# Altium project Audio_Research.PrjPcb (part 2 of 4)

## Sheet Power.SchDoc: Power Regulation
size 279 x 215 mm; DrawnBy: Connor Dack; Engineer: Connor Dack; DocumentNumber: 10; Revision: 1.0; SheetNumber: 10; SheetTotal: 20
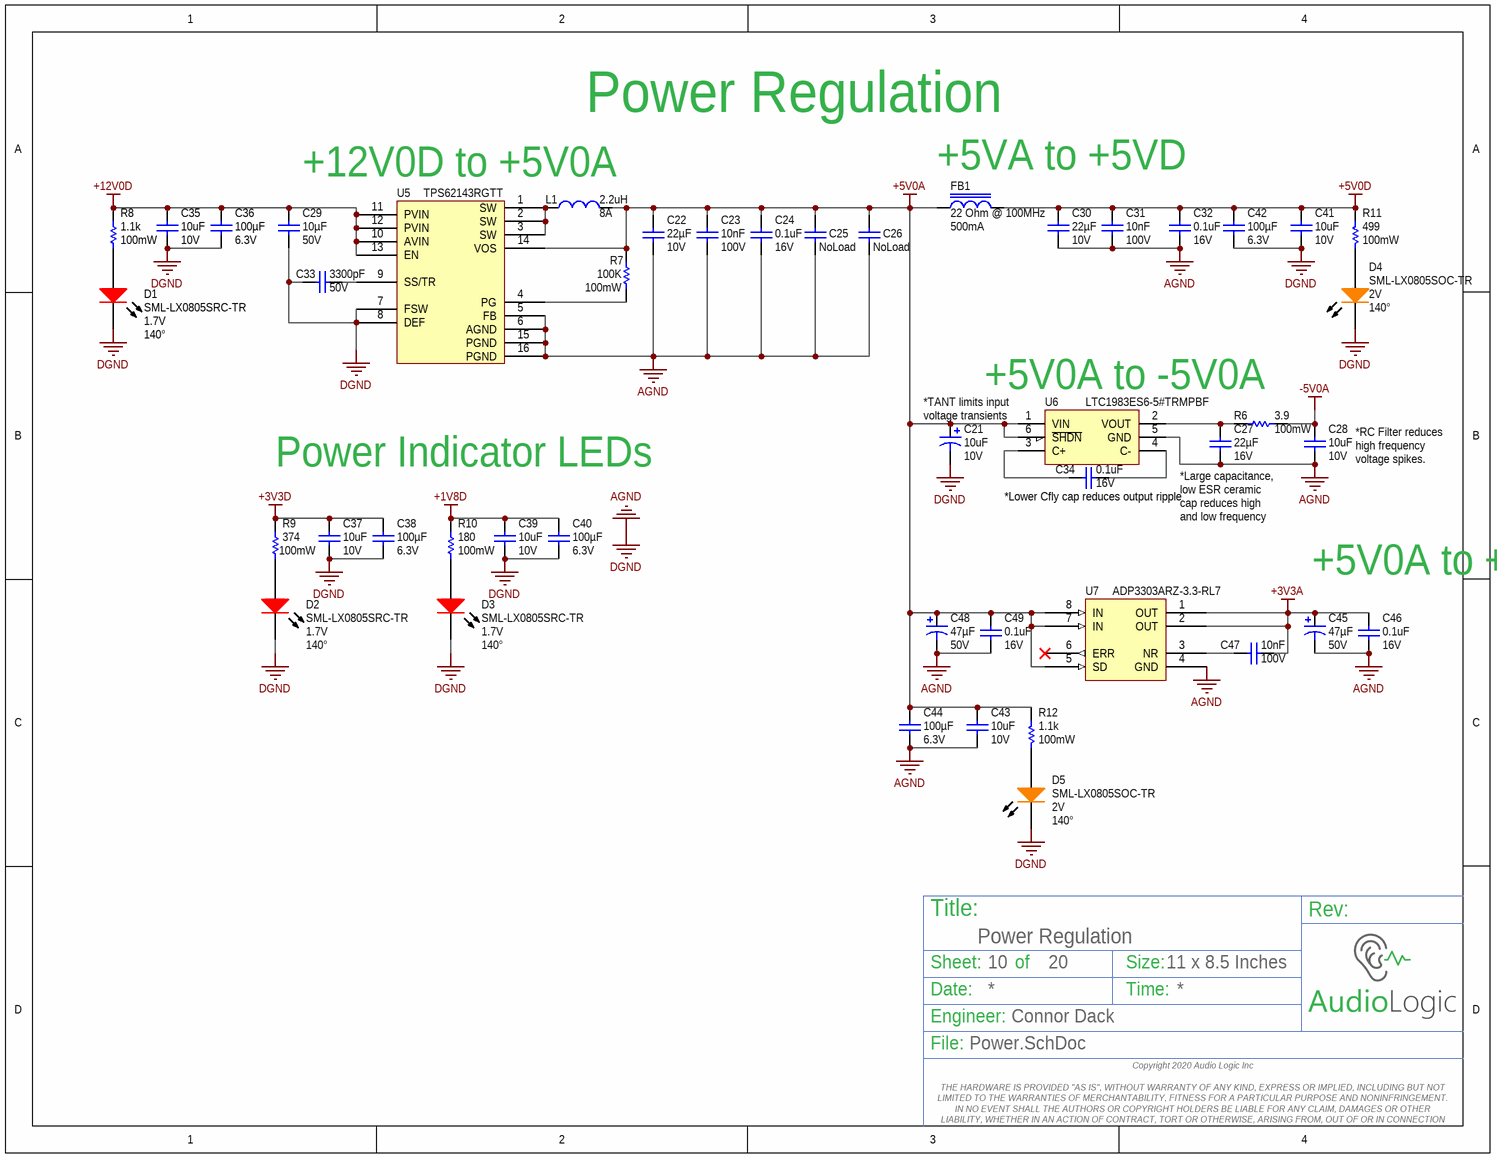
[diagram p5: Power.SchDoc]

### Parts
C21  Voltage: 10V  Capacitance: 10uF  [C1206_TANT]  (hidden comment: TR3A106K010C0900)
C22  Voltage - Rated: 10V  Capacitance: 22µF  [6-0805_L]  (hidden comment: CL21A226KPCLRNC)
C23  Voltage Rating: 100V  Capacitance: 10nF  [3-0603_L]  (hidden comment: C1608X8R2A103K080AA)
C24  Voltage Rating: 16V  Capacitance: 0.1uF  [3-0603_L]  (hidden comment: CL10F104ZO8NNNC)
C25  Capacitance: NoLoad  [3-0603_L]  (hidden comment: CAP 0603)
C26  Capacitance: NoLoad  [3-0603_L]  (hidden comment: CAP 0603)
C27  Voltage - Rated: 16V  Capacitance: 22µF  [C1206]  (hidden comment: C3216X6S1C226M)
C28  Voltage Rating: 10V  Capacitance: 10uF  [3-0603_L]  (hidden comment: GRM188R61A106ME69D)
C29  Voltage - Rated: 50V  Capacitance: 10µF  [C1206]  (hidden comment: C3216X5R1H106K)
C30  Voltage - Rated: 10V  Capacitance: 22µF  [6-0805_L]  (hidden comment: CL21A226KPCLRNC)
C31  Voltage Rating: 100V  Capacitance: 10nF  [3-0603_L]  (hidden comment: C1608X8R2A103K080AA)
C32  Voltage Rating: 16V  Capacitance: 0.1uF  [3-0603_L]  (hidden comment: CL10F104ZO8NNNC)
C33  Voltage - Rated: 50V  Capacitance: 3300pF  [6-0805_L]  (hidden comment: GRM2165C1H332JA01D)
C34  Voltage Rating: 16V  Capacitance: 0.1uF  [3-0603_L]  (hidden comment: CL10F104ZO8NNNC)
C35  Voltage Rating (DC): 10V  Capacitance: 10uF  [3-0603_L]  (hidden comment: GRM188R61A106ME69D)
C36  Voltage - Rated: 6.3V  Capacitance: 100µF  [C1210X25_L]  (hidden comment: CL32X107MQVNNNE)
C37  Voltage Rating: 10V  Capacitance: 10uF  [3-0603_L]  (hidden comment: GRM188R61A106ME69D)
C38  Voltage - Rated: 6.3V  Capacitance: 100µF  [C1210X25_L]  (hidden comment: CL32X107MQVNNNE)
C39  Voltage Rating: 10V  Capacitance: 10uF  [3-0603_L]  (hidden comment: GRM188R61A106ME69D)
C40  Voltage - Rated: 6.3V  Capacitance: 100µF  [C1210X25_L]  (hidden comment: CL32X107MQVNNNE)
C41  Voltage Rating: 10V  Capacitance: 10uF  [3-0603_L]  (hidden comment: GRM188R61A106ME69D)
C42  Voltage - Rated: 6.3V  Capacitance: 100µF  [C1210X25_L]  (hidden comment: CL32X107MQVNNNE)
C43  Voltage Rating: 10V  Capacitance: 10uF  [3-0603_L]  (hidden comment: GRM188R61A106ME69D)
C44  Voltage - Rated: 6.3V  Capacitance: 100µF  [C1210X25_L]  (hidden comment: CL32X107MQVNNNE)
C45  Voltage Rating: 50V  Capacitance: 47µF  [ALUMCAPC630D_D]  (hidden comment: EEE-FT1H470AP)
C46  Voltage Rating: 16V  Capacitance: 0.1uF  [3-0603_L]  (hidden comment: CL10F104ZO8NNNC)
C47  Voltage Rating: 100V  Capacitance: 10nF  [3-0603_L]  (hidden comment: C1608X8R2A103K080AA)
C48  Voltage Rating: 50V  Capacitance: 47µF  [ALUMCAPC630D_D]  (hidden comment: EEE-FT1H470AP)
C49  Voltage Rating: 16V  Capacitance: 0.1uF  [3-0603_L]  (hidden comment: CL10F104ZO8NNNC)
D1  Manufacturer Part Number: SML-LX0805SRC-TR  Voltage - Forward (Vf) (Typ): 1.7V  Viewing Angle: 140°  [DIOM2012X12L_RED]  (hidden comment: LED_RED 4)
D2  Manufacturer Part Number: SML-LX0805SRC-TR  Voltage - Forward (Vf) (Typ): 1.7V  Viewing Angle: 140°  [DIOM2012X12L_RED]  (hidden comment: LED_RED 4)
D3  Manufacturer Part Number: SML-LX0805SRC-TR  Voltage - Forward (Vf) (Typ): 1.7V  Viewing Angle: 140°  [DIOM2012X12L_RED]  (hidden comment: LED_RED 4)
D4  Manufacturer Part Number: SML-LX0805SOC-TR  Voltage - Forward (Vf) (Typ): 2V  Viewing Angle: 140°  [DIOM2012X12L_ORANGE]  (hidden comment: LED_ORANGE 3)
D5  Manufacturer Part Number: SML-LX0805SOC-TR  Voltage - Forward (Vf) (Typ): 2V  Viewing Angle: 140°  [DIOM2012X12L_ORANGE]  (hidden comment: LED_ORANGE 3)
FB1  Current Rating: 500mA  Impedance @ Frequency: 22 Ohm @ 100MHz  [3-0603_L]  (hidden comment: BLM18BA220SN1D)
L1  Max DC Current: 8A  Inductance: 2.2uH  [XFL4020]  (hidden comment: 2.2uH Ind)
R6  Power (Watts): 100mW  Resistance (Ohms): 3.9  [3-0603_R_L]  (hidden comment: ERJ-3RQF3R9V)
R7  Power (Watts): 100mW  Resistance (Ohms): 100K  [3-0603_R_L]  (hidden comment: ERJ-3EKF1003V)
R8  Power Rating: 100mW  Resistance: 1.1k  [3-0603_R_L]  (hidden comment: RMCF0603FT1K10)
R9  Power (Watts): 100mW  Resistance (Ohms): 374  [3-0603_R_L]  (hidden comment: ERJ-3EKF3740V)
R10  Power Rating: 100mW  Resistance: 180  [3-0603_R_L]  (hidden comment: ERA-3AEB181V)
R11  Power (Watts): 100mW  Resistance (Ohms): 499  [3-0603_R_L]  (hidden comment: ERJ-3EKF4990V)
R12  Power Rating: 100mW  Resistance: 1.1k  [3-0603_R_L]  (hidden comment: RMCF0603FT1K10)
U5  IC REG BUCK 5V 2A SYNC 16QFN  [QFN50P300X300X100_HS-17N]  (value not drawn)
U6  (no value)  [SOT23-6_L]
U7  ADP3303ARZ-3.3-RL7  [SOIC127P600X175-8L]

### Nets
+1V8D: C39.2 C40.2 R10.2
+3V3A: C45.1(P) C46.1 C47.1 U7.1(OUT) U7.2(OUT)
+3V3D: C37.2 C38.2 R9.2
+5V0A: C21.1(P) C22.2 C23.2 C24.1 C25.2 C26.2 C43.2 C44.2 C48.1(P) C49.1 FB1.1 L1.2 R7.2 R12.2 U5.14(VOS) U6.1(VIN) U6.6(~{SHDN}) U7.5(SD) U7.7(IN) U7.8(IN)
+5V0D: C30.2 C31.2 C32.1 C41.2 C42.2 FB1.2 R11.2
+12V0D: C29.2 C35.2 C36.2 R8.2 U5.10(AVIN) U5.11(PVIN) U5.12(PVIN) U5.13(EN)
-5V0A: C28.2 R6.2
AGND: C21.2(N) C22.1 C23.1 C24.2 C25.1 C26.1 C27.1 C28.1 C29.1 C30.1 C31.1 C32.2 C33.1 C35.1 C36.1 C37.1 C38.1 C39.1 C40.1 C41.1 C42.1 C43.1 C44.1 C45.2(N) C46.2 C48.2(N) C49.2 D1.2(K) D2.2(K) D3.2(K) D4.2(K) D5.2(K) U5.5(FB) U5.6(AGND) U5.7(FSW) U5.8(DEF) U5.15(PGND) U5.16(PGND) U6.5(GND) U7.4(GND)  [also labelled DGND]
NetC27_2: C27.2 R6.1 U6.2(VOUT)
NetC33_2: C33.2 U5.9(SS/TR)
NetC34_1: C34.1 U6.3(C+)
NetC34_2: C34.2 U6.4(C-)
NetC47_2: C47.2 U7.3(NR)
NetD1_1: D1.1(A) R8.1
NetD2_1: D2.1(A) R9.1
NetD3_1: D3.1(A) R10.1
NetD4_1: D4.1(A) R11.1
NetD5_1: D5.1(A) R12.1
NetL1_1: L1.1 U5.1(SW) U5.2(SW) U5.3(SW)
NetR7_1: R7.1 U5.4(PG)

Not connected (* = marked no-connect by the designer): U7 6(ERR)*

### Notes on the sheet
- Power Regulation
- +12V0D to +5V0A
- +5VA to +5VD
- (near C21) *TANT limits input voltage transients
- +5V0A to -5V0A
- Power Indicator LEDs
- (near C34) *Lower Cfly cap reduces output ripple
- (near C28) *RC Filter reduces high frequency voltage spikes.
- (near C27) *Large capacitance, low ESR ceramic cap reduces high and low frequency ripple.
- +5V0A to +3V3A
- Title:
- Sheet:
- of
- Size:
- 11 x 8.5 Inches
- Rev:
- Date:
- Engineer:
- Time:
- File:
- Copyright 2020 Audio Logic Inc
  THE HARDWARE IS PROVIDED "AS IS", WITHOUT WARRANTY OF ANY KIND, EXPRESS OR IMPLIED, INCLUDING BUT NOT LIMITED TO THE WARRANTIES OF MERCHANTABILITY, FITNESS FOR A PARTICULAR PURPOSE AND NONINFRINGEMENT. IN NO EVENT SHALL THE AUTHORS OR COPYRIGHT HOLDERS BE LIABLE FOR ANY CLAIM, DAMAGES OR OTHER LIABILITY, WHETHER IN AN ACTION OF CONTRACT, TORT OR OTHERWISE, ARISING FROM, OUT OF OR IN CONNECTION WITH THE HARDWARE OR THE USE OR OTHER DEALINGS IN THE HARDWARE.

### Library data of the parts
C21 = TR3A106K010C0900: CAP TANT 10UF 10V 10% 1206; Manufacturer: Vishay Sprague; Dielectric Material: Tantalum; ESR (Equivalent Series Resistance): 900mR; Ripple Current: 290mA; Leakage Current: 1uA; Polarity: Polar; Dissipation Factor: 6%; Notes: FE Provides; Manufacturer Part Number: TR3A106K010C0900; Stock 1: 0; Pricing 1: 1=0.9, 10=0.688, 100=0.4919, 500=0.3808, 1000=0.32791 (USD); Mount: Surface Mount,PCB; Case/Package: 1206; Case Code (Imperial): 1206; Case Code (Metric): 3216; Min Operating Temperature: -55°C; Max Operating Temperature: 125°C; Tolerance: 10%; Voltage Rating: 10V; Packaging: Tape and Reel; Package Quantity: 1; Termination: SMD/SMT; Voltage Rating (DC): 10V; Features: General Purpose; Length: 3.2mm; Height: 1.6mm; Width: 1.6mm; Height - Seated (Max): 0.071inch; Depth: 1.6mm; Radiation Hardening: No; REACH SVHC: Unknown; ComponentLink1URL: https://datasheet.ciiva.com/8070/438325-8070341.pdf; ComponentLink1Description: https://datasheet.ciiva.com/8070/438325-8070341.pdf; ComponentLink2URL: https://datasheet.ciiva.com/258/tr3-258855.pdf; ComponentLink2Description: https://datasheet.ciiva.com/258/tr3-258855.pdf; ComponentLink3URL: https://datasheet.ciiva.com/258/tr3-258856.pdf; ComponentLink3Description: https://datasheet.ciiva.com/258/tr3-258856.pdf; ComponentLink4URL: https://datasheet.ciiva.com/258/tr3-258857.pdf; ComponentLink4Description: https://datasheet.ciiva.com/258/tr3-258857.pdf; ComponentLink5URL: https://datasheet.ciiva.com/3004/tr3-3004715.pdf; ComponentLink5Description: https://datasheet.ciiva.com/3004/tr3-3004715.pdf; ComponentLink6URL: https://datasheet.ciiva.com/11793/0900766b80d9a43c-11793740.pdf; ComponentLink6Description: https://datasheet.ciiva.com/11793/0900766b80d9a43c-11793740.pdf; ComponentLink7URL: https://datasheet.ciiva.com/22695/1923401-22695197.pdf; ComponentLink7Description: https://datasheet.ciiva.com/22695/1923401-22695197.pdf; Supplier 1: Digi-Key; Supplier Part Number 1: 718-1460-6-ND
C22 C30 = CL21A226KPCLRNC: CAP CER 22UF 10V X5R 0805; Manufacturer: Samsung Electro-Mechanics America, Inc.; Tolerance: ±10%; Supplier 1: Digi-Key; Manufacturer Part Number: CL21A226KPCLRNC; RoHS: RoHS Compliant; Category: Capacitors; Stock 1: 70317; Pricing 1: 1=0.25, 10=0.173, 25=0.1384, 50=0.1154, 100=0.0981, 250=0.07788, 500=0.06924, 1000=0.06059 (USD); Packaging: Cut Tape (CT); Part Status: Active; Temperature Coefficient: X5R; Operating Temperature: -55°C ~ 85°C; Features: Low Profile; Ratings: -; Applications: General Purpose; Failure Rate: *; Mounting Type: Surface Mount, MLCC; Package / Case: 0805 (2012 Metric); Size / Dimension: 0.079" L x 0.049" W (2.00mm x 1.25mm); Height - Seated (Max): -; Thickness (Max): 0.037" (0.95mm); Lead Spacing: -; Lead Style: -; ComponentLink1URL: http://www.samsungsem.com/kr/support/product-search/mlcc/__icsFiles/afieldfile/2016/08/18/S_CL21A226KPCLRNC.pdf; ComponentLink1Description: http://www.samsungsem.com/kr/support/product-search/mlcc/__icsFiles/afieldfile/2016/08/18/S_CL21A226KPCLRNC.pdf; Supplier Part Number 1: 1276-6786-1-ND; Load Status: *
C23 C31 C47 = C1608X8R2A103K080AA: CAP CER 10000PF 100V X8R 0603; Manufacturer: TDK; Tolerance: 10%; Supplier 1: Digi-Key; Manufacturer Part Number: C1608X8R2A103K080AA; Stock 1: 1372; Pricing 1: 1=0.22, 10=0.16, 100=0.075, 500=0.05262, 1000=0.04356 (USD); Mount: Surface Mount; Case/Package: 0603; Number of Pins: 2; Weight: 7.1E-05oz; Case Code (Metric): 1608; Case Code (Imperial): 0603; Min Operating Temperature: -55°C; Max Operating Temperature: 150°C; Package Quantity: 1; Packaging: Tape and Reel; Voltage Rating (DC): 100V; Dielectric: X8R; Termination: SMD/SMT; Composition: Ceramic; Length: 1.6mm; Height: 0.8mm; Width: 0.031inch; Thickness: 0.037inch; Depth: 0.8mm; REACH SVHC: No SVHC; ComponentLink1URL: https://datasheet.ciiva.com/24218/c1608x8r2a103k080aa-264763-24218790.pdf; ComponentLink1Description: https://datasheet.ciiva.com/24218/c1608x8r2a103k080aa-264763-24218790.pdf; Supplier Part Number 1: 445-2510-6-ND
C24 C32 C34 C46 C49 = CL10F104ZO8NNNC: CAP CER 0.1UF 16V Y5V 0603; Manufacturer: Samsung; Tolerance: 80%; Supplier 1: Digi-Key; Stock 1: 40000; Pricing 1: 1=0.1, 10=0.038, 100=0.0169, 500=0.01208, 1000=0.00949 (USD); Mount: Surface Mount; Case/Package: 0603; Case Code (Metric): 1608; Case Code (Imperial): 0603; Min Operating Temperature: -30°C; Max Operating Temperature: 85°C; Package Quantity: 1; Packaging: Tape and Reel; Dielectric: Y5V; Length: 1.6mm; Height: 0.8mm; Width: 0.031inch; Thickness: 0.035inch; Depth: 0.8mm; Radiation Hardening: No; ComponentLink1URL: https://datasheet.ciiva.com/25805/cl10f104zo8nnnc-25805810.pdf; ComponentLink1Description: https://datasheet.ciiva.com/25805/cl10f104zo8nnnc-25805810.pdf; ComponentLink2URL: https://datasheet.ciiva.com/16199/cl10f104zo8nnnc-16199254.pdf; ComponentLink2Description: https://datasheet.ciiva.com/16199/cl10f104zo8nnnc-16199254.pdf; Supplier Part Number 1: 1276-1258-6-ND; Manufacturer Part Number: CL10F104ZO8NNNC
C25 C26 = CAP 0603: CAP 0603 SMD - NoLoad; Load Status: Do Not Install
C27 = C3216X6S1C226M: CAP CER 22UF 16V 20% X6S 1206; Manufacturer: TDK Corporation; Notes: FE Provides; Supplier 1: Digi-Key; Manufacturer Part Number: C3216X6S1C226M; RoHS: RoHS Compliant; Category: Capacitors; Stock 1: 4138; Pricing 1: 1=1.13, 10=0.94, 100=0.6, 250=0.5, 500=0.45, 1000=0.41 (USD); Tolerance: ±20%; Temperature Coefficient: X6S; Mounting Type: Surface Mount, MLCC; Operating Temperature: -55°C ~ 105°C; Applications: General Purpose; Ratings: -; Package / Case: 1206 (3216 Metric); Size / Dimension: 0.126" L x 0.063" W (3.20mm x 1.60mm); Height - Seated (Max): -; Thickness (Max): -; Lead Spacing: -; Features: -; Packaging: Cut Tape (CT); Lead Style: -; ComponentLink1URL: http://www.tdk.com/pdf/general_B11.pdf; ComponentLink1Description: http://www.tdk.com/pdf/general_B11.pdf; Supplier Part Number 1: 445-8044-1-ND
C28 C35 C37 C39 C41 C43 = GRM188R61A106ME69D: CAP CER 10UF 10V X5R 0603; Manufacturer: Murata; Material: Ceramic; Tolerance: 20%; Supplier 1: Digi-Key; Manufacturer Part Number: GRM188R61A106ME69D; Stock 1: 40000; Pricing 1: 1=0.22, 10=0.149, 100=0.0754, 500=0.05158, 1000=0.04563 (USD); Mount: Surface Mount; Case/Package: 0603; Weight: 0.000222oz; Case Code (Metric): 1608; Case Code (Imperial): 0603; Min Operating Temperature: -55°C; Max Operating Temperature: 85°C; Packaging: Tape and Reel; Dielectric: X5R; Termination: SMD/SMT; Package Quantity: 4000; Length: 1.6mm; Height: 0.8mm; Width: 0.8mm; Thickness: 0.035inch; Depth: 0.8mm; REACH SVHC: Unknown; Lead Free: Lead Free; ComponentLink1URL: http://components.arrow.com/part/dataview/0323_06119472; ComponentLink1Description: http://components.arrow.com/part/dataview/0323_06119472; ComponentLink2URL: http://www.farnell.com/datasheets/2048014.pdf; ComponentLink2Description: http://www.farnell.com/datasheets/2048014.pdf; ComponentLink3URL: http://search.murata.co.jp/Ceramy/image/img/A01X/G101/ENG/GRM188R61A106ME69-01.pdf; ComponentLink3Description: http://search.murata.co.jp/Ceramy/image/img/A01X/G101/ENG/GRM188R61A106ME69-01.pdf; ComponentLink4URL: http://www.mouser.com/ds/2/281/c02e-2905.pdf; ComponentLink4Description: http://www.mouser.com/ds/2/281/c02e-2905.pdf; ComponentLink5URL: http://www.farnell.com/datasheets/1872210.pdf; ComponentLink5Description: http://www.farnell.com/datasheets/1872210.pdf; Supplier Part Number 1: 490-10475-6-ND
  C28 C37 C39 C41 C43: Voltage Rating (DC): 10V
  C35: Voltage Rating: 10V
C29 = C3216X5R1H106K: CAP CER 10UF 50V 10% X5R 1206; Manufacturer: TDK Corporation; Supplier 1: Digi-Key; Manufacturer Part Number: C3216X5R1H106K; RoHS: RoHS Compliant; Category: Capacitors; Stock 1: 39464; Pricing 1: 1=1.01, 10=0.846, 100=0.54, 250=0.45, 500=0.405, 1000=0.369 (USD); Tolerance: ±10%; Temperature Coefficient: X5R; Mounting Type: Surface Mount, MLCC; Operating Temperature: -55°C ~ 85°C; Applications: General Purpose; Ratings: -; Package / Case: 1206 (3216 Metric); Size / Dimension: 0.126" L x 0.063" W (3.20mm x 1.60mm); Height - Seated (Max): -; Thickness (Max): 0.071" (1.80mm); Lead Spacing: -; Features: -; Packaging: Cut Tape (CT); Lead Style: -; ComponentLink1URL: http://www.tdk.com/pdf/general_B11.pdf; ComponentLink1Description: http://www.tdk.com/pdf/general_B11.pdf; Supplier Part Number 1: 445-5998-1-ND
C33 = GRM2165C1H332JA01D: CAP CER 3300PF 50V NP0 0805; Manufacturer: Murata Electronics North America; Tolerance: ±5%; Temperature Coefficient: C0G, NP0; Supplier 1: Digi-Key; Manufacturer Part Number: GRM2165C1H332JA01D; RoHS: RoHS Compliant; Category: Capacitors; Stock 1: 67484; Pricing 1: 1=0.17, 10=0.12, 50=0.069, 100=0.057, 250=0.048, 500=0.0402, 1000=0.033 (USD); Packaging: Cut Tape (CT); Part Status: Active; Operating Temperature: -55°C ~ 125°C; Ratings: -; Applications: General Purpose; Mounting Type: Surface Mount, MLCC; Package / Case: 0805 (2012 Metric); Size / Dimension: 0.079" L x 0.049" W (2.00mm x 1.25mm); Thickness (Max): 0.028" (0.70mm); ComponentLink1URL: http://www.murata.com/~/media/webrenewal/support/library/catalog/products/capacitor/mlcc/c02e.pdf; ComponentLink1Description: http://www.murata.com/~/media/webrenewal/support/library/catalog/products/capacitor/mlcc/c02e.pdf; Supplier Part Number 1: 490-1632-1-ND
C36 C38 C40 C42 C44 = CL32X107MQVNNNE: 100µF 6.3V Ceramic Capacitor X6S 1210 (3225 Metric) 0.126" L x 0.098" W (3.20mm x 2.50mm); Manufacturer: Samsung Electro-Mechanics America, Inc.; Tolerance: ±20%; Supplier 1: Digi-Key; Manufacturer Part Number: CL32X107MQVNNNE; RoHS: RoHS Compliant; Category: Capacitors; Stock 1: 19666; Pricing 1: 1=1.35, 10=1.13, 25=0.974, 50=0.914, 100=0.7215, 500=0.54112 (USD); Packaging: Cut Tape (CT); Part Status: Active; Temperature Coefficient: X6S; Mounting Type: Surface Mount, MLCC; Operating Temperature: -55°C ~ 105°C; Applications: General Purpose; Ratings: -; Package / Case: 1210 (3225 Metric); Size / Dimension: 0.126" L x 0.098" W (3.20mm x 2.50mm); Height - Seated (Max): -; Thickness (Max): 0.110" (2.80mm); Lead Spacing: -; Features: -; Lead Style: -; ComponentLink1URL: http://www.samsungsem.com/kr/front/downloadcms.do?path=/kr/support/product-search/mlcc/__icsFiles/afieldfile/2014/11/05&fileName=C_CL32X107MQVNNNE.pdf; ComponentLink1Description: http://www.samsungsem.com/kr/front/downloadcms.do?path=/kr/support/product-search/mlcc/__icsFiles/afieldfile/2014/11/05&fileName=C_CL32X107MQVNNNE.pdf; Supplier Part Number 1: 1276-3399-1-ND
C45 C48 = EEE-FT1H470AP: CAP ALUM 47UF 50V 20% SMD; Manufacturer: Panasonic - ECG; Lifetime @ Temp.: 2000 Hrs @ 105°C; Ripple Current: 195mA; ESR (Equivalent Series Resistance): 680.0 mOhm; Surface Mount Land Size: 0.260" L x 0.260" W (6.60mm x 6.60mm); Supplier 1: Digi-Key; Manufacturer Part Number: EEE-FT1H470AP; RoHS: RoHS Compliant; Category: Capacitors; Stock 1: 1772; Pricing 1: 1=0.81, 50=0.4834, 100=0.4229, 250=0.33232, 500=0.3021 (USD); Tolerance: ±20%; Operating Temperature: -55°C ~ 105°C; Features: General Purpose; Impedance: -; Mounting Type: Surface Mount; Package / Case: Radial, Can - SMD; Size / Dimension: 0.248" Dia (6.30mm); Height - Seated (Max): 0.240" (6.10mm); Lead Spacing: -; Packaging: Cut Tape (CT); ComponentLink1URL: http://industrial.panasonic.com/www-cgi/jvcr17pz.cgi?E+PZ+4+ABA0134+0+WW; ComponentLink1Description: http://industrial.panasonic.com/www-cgi/jvcr17pz.cgi?E+PZ+4+ABA0134+0+WW; Supplier Part Number 1: PCE5023CT-ND
D1-D3 = LED_RED 4: LED 660NM SUPER RED CLR 0805 T/R; Manufacturer: Lumex Opto/Components Inc; Millicandela Rating: 25mcd; Current - Test: 20mA; Lens Type: Clear; Supplier 1: Digi-Key; RoHS: RoHS Compliant; Category: Optoelectronics; Stock 1: 1141; Pricing 1: 1=0.56, 10=0.395, 100=0.2596, 250=0.19472, 500=0.177, 1000=0.1416 (USD); Packaging: Cut Tape (CT); Color: Red; Wavelength - Dominant: -; Wavelength - Peak: 660nm; Lens Style/Size: *; Package / Case: 0805 (2012 Metric); Size / Dimension: 2.00mm L x 1.25mm W; Height: 1.10mm; Mounting Type: Surface Mount; Luminous Flux @ Current - Test: -; ComponentLink1URL: http://www.lumex.com/specs/SML-LX0805SRC-TR.pdf; ComponentLink1Description: http://www.lumex.com/specs/SML-LX0805SRC-TR.pdf; Supplier Part Number 1: 67-2191-1-ND
D4 D5 = LED_ORANGE 3: LED 610NM SUPER ORANGE 0805 SMD; Manufacturer: Lumex Opto/Components Inc; Millicandela Rating: 60mcd; Current - Test: 20mA; Lens Type: Clear; Lens Style/Size: Rectangle with Flat Top, 1.4mm x 1.25mm; Notes: FE Provides; Supplier 1: Digi-Key; RoHS: RoHS Compliant; Category: Optoelectronics; Stock 1: 13373; Pricing 1: 1=0.65, 10=0.502, 100=0.3255, 250=0.279, 500=0.2418, 1000=0.186 (USD); Packaging: Cut Tape (CT); Color: Orange; Wavelength - Dominant: -; Wavelength - Peak: 610nm; Package / Case: 0805 (2012 Metric); Size / Dimension: 2.00mm L x 1.25mm W; Height: 1.10mm; Mounting Type: Surface Mount; Luminous Flux @ Current - Test: -; ComponentLink1URL: http://www.lumex.com/specs/SML-LX0805SOC-TR.pdf; ComponentLink1Description: http://www.lumex.com/specs/SML-LX0805SOC-TR.pdf; Supplier Part Number 1: 67-1637-1-ND
FB1 = BLM18BA220SN1D: FERRITE CHIP 22 OHM 500MA 0603; Manufacturer: Murata Electronics North America; DC Resistance (DCR): 350 mOhm Max; Filter Type: Differential Mode - Single; Supplier 1: Digi-Key; Manufacturer Part Number: BLM18BA220SN1D; RoHS: RoHS Compliant; Category: Filters; Stock 1: 10969; Pricing 1: 1=0.24, 10=0.18, 50=0.105, 100=0.084, 250=0.06, 500=0.0408, 1000=0.033 (USD); Package / Case: 0603 (1608 Metric); Mounting Type: Surface Mount; Packaging: Cut Tape (CT); Height (Max): 0.037" (0.95mm); Size / Dimension: 0.063" L x 0.031" W (1.60mm x 0.80mm); ComponentLink1URL: http://search.murata.co.jp/Ceramy/image/img/PDF/ENG/L0110S0100BLM18B.pdf; ComponentLink1Description: http://search.murata.co.jp/Ceramy/image/img/PDF/ENG/L0110S0100BLM18B.pdf; Supplier Part Number 1: 490-1016-1-ND; Load Status: *
L1 = XFL4020-222MEB: Fixed Inductors XFL4020 AEC-Q200 2.2 uH 20 % 8 A; Manufacturer: Coilcraft; Core Material: Composite; Tolerance: 20%; Self Resonant Frequency: 38MHz; Shielding: Shielded; DC Resistance (DCR): 23.5mR; Test Frequency: 100kHz; Stock 1: 13478; Pricing 1: 1=1.99, 10=1.99, 50=1.99, 100=1.59, 1000=0.885, 10000=0.824 (USD); Min Operating Temperature: -40°C; Max Operating Temperature: 125°C; Packaging: Tape and Reel; Package Quantity: 25; Termination: SMD/SMT; Length: 4.3mm; Height: 2.1mm; Width: 4.3mm; Lead Free: Contains Lead; ComponentLink1URL: http://www.mouser.com/ds/2/597/xfl4020-270756.pdf; ComponentLink1Description: http://www.mouser.com/ds/2/597/xfl4020-270756.pdf; Supplier Part Number 1: 994-XFL4020-222MEB; Supplier 1: Mouser; Manufacturer Part Number: XFL4020-222MEB
R6 = ERJ-3RQF3R9V: RES 3.9 OHM 1/10W 1% 0603 SMD; Manufacturer: Panasonic Electronic Components; Temperature Coefficient: ±200ppm/°C; Notes: FE Provides; Supplier 1: Digi-Key; Manufacturer Part Number: ERJ-3RQF3R9V; RoHS: RoHS Compliant; Category: Resistors; Stock 1: 44573; Pricing 1: 1=0.29, 50=0.1138, 100=0.0878, 250=0.06824, 500=0.0481, 1000=0.0351 (USD); Packaging: Cut Tape (CT); Tolerance: ±1%; Composition: Thick Film; Features: -; Package / Case: 0603 (1608 Metric); Supplier Device Package: 0603; Size / Dimension: 0.063" L x 0.031" W (1.60mm x 0.80mm); Height: 0.022" (0.55mm); Number of Terminations: 2; ComponentLink1URL: http://industrial.panasonic.com/www-cgi/jvcr13pz.cgi?E+PZ+3+AOA0003+ERJ3RQF3R9V+7+WW; ComponentLink1Description: http://industrial.panasonic.com/www-cgi/jvcr13pz.cgi?E+PZ+3+AOA0003+ERJ3RQF3R9V+7+WW; Supplier Part Number 1: P3.9AJCT-ND
R7 = ERJ-3EKF1003V: RES 100K OHM 1/10W 1% 0603 SMD; Manufacturer: Panasonic - ECG; Temperature Coefficient: ±100ppm/°C; Supplier 1: Digi-Key; Manufacturer Part Number: ERJ-3EKF1003V; RoHS: RoHS Compliant; Category: Resistors; Stock 1: 7213152; Pricing 1: 1=0.1, 50=0.0138, 100=0.0105, 250=0.0078, 500=0.00576, 1000=0.00384 (USD); Composition: Thick Film; Features: -; Tolerance: ±1%; Package / Case: 0603 (1608 Metric); Size / Dimension: 0.063" L x 0.031" W (1.60mm x 0.80mm); Height: 0.022" (0.55mm); Number of Terminations: 2; Packaging: Cut Tape (CT); ComponentLink1URL: http://industrial.panasonic.com/www-cgi/jvcr13pz.cgi?E+PZ+3+AOA0002+ERJ3EKF1003V+7+WW; ComponentLink1Description: http://industrial.panasonic.com/www-cgi/jvcr13pz.cgi?E+PZ+3+AOA0002+ERJ3EKF1003V+7+WW; Supplier Part Number 1: P100KHCT-ND
R8 R12 = RMCF0603FT1K10: RES 1.1K OHM 1% 1/10W 0603; Manufacturer: Stackpole Electronics; Temperature Coefficient: 100ppm/°C; Supplier 1: Digi-Key; Manufacturer Part Number: RMCF0603FT1K10; Stock 1: 3279; Pricing 1: 1=0.1, 10=0.017, 100=0.0069, 1000=0.00309, 2500=0.00268 (USD); Mount: Surface Mount; Case/Package: 0603; Case Code (Metric): 1608; Case Code (Imperial): 0603; Contact Plating: Tin,Matte; Min Operating Temperature: -55°C; Max Operating Temperature: 155°C; Tolerance: 1%; Packaging: Tape and Reel; Composition: Thick Film; Number of Terminations: 2; Max Power Dissipation: 100mW; Length: 0.061inch; Height: 0.022inch; Width: 0.031inch; Radiation Hardening: No; Lead Free: Lead Free; ComponentLink1URL: https://www.seielect.com/catalog/SEI-RMCF_RMCP.pdf; ComponentLink1Description: https://www.seielect.com/catalog/SEI-RMCF_RMCP.pdf; ComponentLink2URL: http://components.arrow.com/part/dataview/44988020S6797459N1174; ComponentLink2Description: http://components.arrow.com/part/dataview/44988020S6797459N1174; ComponentLink3URL: https://www.seielect.com/catalog/SEI-Packaging.pdf; ComponentLink3Description: https://www.seielect.com/catalog/SEI-Packaging.pdf; ComponentLink4URL: http://www.seielect.com/Catalog/SEI-RMC.pdf; ComponentLink4Description: http://www.seielect.com/Catalog/SEI-RMC.pdf; Supplier Part Number 1: RMCF0603FT1K10DKR-ND
R9 = ERJ-3EKF3740V: RES SMD 374 OHM 1% 1/10W 0603; Manufacturer: Panasonic Electronic Components; Temperature Coefficient: ±100ppm/°C; Supplier 1: Digi-Key; Manufacturer Part Number: ERJ-3EKF3740V; RoHS: RoHS Compliant; Category: Resistors; Stock 1: 48031; Pricing 1: 1=0.1, 50=0.0114, 100=0.0084, 250=0.00644, 500=0.00514, 1000=0.00379 (USD); Packaging: Cut Tape (CT); Part Status: Active; Tolerance: ±1%; Composition: Thick Film; Features: Automotive AEC-Q200; Operating Temperature: -55°C ~ 155°C; Package / Case: 0603 (1608 Metric); Supplier Device Package: 0603; Size / Dimension: 0.063" L x 0.031" W (1.60mm x 0.80mm); Height: 0.022" (0.55mm); Number of Terminations: 2; ComponentLink1URL: http://industrial.panasonic.com/www-cgi/jvcr13pz.cgi?E+PZ+3+AOA0002+ERJ3EKF3740V+7+WW; ComponentLink1Description: http://industrial.panasonic.com/www-cgi/jvcr13pz.cgi?E+PZ+3+AOA0002+ERJ3EKF3740V+7+WW; Supplier Part Number 1: P374HCT-ND
R10 = ERA-3AEB181V: RES SMD 180 OHM 0.1% 1/10W 0603; Manufacturer: Panasonic; Manufacturer Part Number: ERA3AEB181V; Voltage Rating: 75V; Temperature Coefficient: 25ppm/°C; Stock 1: 9289; Pricing 1: 1=0.35, 10=0.3, 100=0.1172, 1000=0.0491, 2500=0.045 (USD); Mount: Surface Mount; Case/Package: 0603; Number of Pins: 2; Case Code (Metric): 1608; Case Code (Imperial): 0603; Contact Plating: Tin; Min Operating Temperature: -55°C; Max Operating Temperature: 155°C; Composition: Thin Film; Tolerance: 0.1%; Packaging: Tape and Reel; Package Quantity: 1; Number of Terminations: 2; Termination: SMD/SMT; Military Standard: Not; Max Power Dissipation: 100mW; Voltage Rating (DC): 75V; Length: 1.6mm; Height: 0.45mm; Width: 0.8mm; Depth: 0.8mm; Radiation Hardening: No; REACH SVHC: No SVHC; Lead Free: Lead Free; ComponentLink1URL: https://datasheet.ciiva.com/11808/0900766b80fe20f7-11808021.pdf; ComponentLink1Description: https://datasheet.ciiva.com/11808/0900766b80fe20f7-11808021.pdf; ComponentLink2URL: https://datasheet.ciiva.com/9184/aoa0000ce26-9184902.pdf; ComponentLink2Description: https://datasheet.ciiva.com/9184/aoa0000ce26-9184902.pdf; ComponentLink3URL: https://datasheet.ciiva.com/30263/54aoa0000ce26-30263318.pdf; ComponentLink3Description: https://datasheet.ciiva.com/30263/54aoa0000ce26-30263318.pdf; ComponentLink4URL: https://datasheet.ciiva.com/5860/485442-5860503.pdf; ComponentLink4Description: https://datasheet.ciiva.com/5860/485442-5860503.pdf; ComponentLink5URL: https://datasheet.ciiva.com/48425/era-eng-tds-48425431.pdf; ComponentLink5Description: https://datasheet.ciiva.com/48425/era-eng-tds-48425431.pdf; ComponentLink6URL: https://datasheet.ciiva.com/5860/485442-5860505.pdf; ComponentLink6Description: https://datasheet.ciiva.com/5860/485442-5860505.pdf; ComponentLink7URL: https://datasheet.ciiva.com/9117/aoa0000ce26-9117390.pdf; ComponentLink7Description: https://datasheet.ciiva.com/9117/aoa0000ce26-9117390.pdf; ComponentLink8URL: https://datasheet.ciiva.com/7909/485442-7909087.pdf; ComponentLink8Description: https://datasheet.ciiva.com/7909/485442-7909087.pdf; ComponentLink9URL: https://datasheet.ciiva.com/48530/era-eng-tds-48530575.pdf; ComponentLink9Description: https://datasheet.ciiva.com/48530/era-eng-tds-48530575.pdf; ComponentLink10URL: https://datasheet.ciiva.com/29183/450425-da-01-en-widerstand-0603-era-29183672.pdf; ComponentLink10Description: https://datasheet.ciiva.com/29183/450425-da-01-en-widerstand-0603-era-29183672.pdf; Supplier 1: Digi-Key; Supplier Part Number 1: P180DBDKR-ND
R11 = ERJ-3EKF4990V: RES 499 OHM 1/10W 1% 0603 SMD; Manufacturer: Panasonic - ECG; Temperature Coefficient: ±100ppm/°C; Supplier 1: Digi-Key; Manufacturer Part Number: ERJ-3EKF4990V; RoHS: RoHS Compliant; Category: Resistors; Stock 1: 748630; Pricing 1: 1=0.1, 50=0.0138, 100=0.0105, 250=0.0078, 500=0.00576, 1000=0.00384 (USD); Composition: Thick Film; Features: -; Tolerance: ±1%; Package / Case: 0603 (1608 Metric); Size / Dimension: 0.063" L x 0.031" W (1.60mm x 0.80mm); Height: 0.022" (0.55mm); Number of Terminations: 2; Packaging: Cut Tape (CT); ComponentLink1URL: http://industrial.panasonic.com/www-cgi/jvcr13pz.cgi?E+PZ+3+AOA0002+ERJ3EKF4990V+7+WW; ComponentLink1Description: http://industrial.panasonic.com/www-cgi/jvcr13pz.cgi?E+PZ+3+AOA0002+ERJ3EKF4990V+7+WW; Supplier Part Number 1: P499HCT-ND
U5 = TPS62143RGTT: Buck Switching Regulator IC Positive Fixed 5V 1 Output 2A 16-VFQFN Exposed Pad; Manufacturer: Texas Instruments; Switching Frequency: 2.5MHz; Number of Outputs: 1; Max Input Voltage: 17V; Min Input Voltage: 3V; Synchronous Rectifier: Yes; Quiescent Current: 17uA; Supplier 1: Digi-Key; Stock 1: 1958; Pricing 1: 1=2.57, 10=2.306, 100=1.8538 (USD); Case/Package: VQFN; Number of Pins: 16; Min Operating Temperature: -40°C; Max Operating Temperature: 125°C; Output Voltage: 5V; Output Current: 2A; Packaging: Tape and Reel; Package Quantity: 250; Nominal Output Voltage: 5V; Max Output Current: 2A; Min Output Voltage: 5V; Max Output Voltage: 5V; Operating Supply Voltage: 17V; Length: 3.15mm; Height: 0.95mm; Width: 3.15mm; Radiation Hardening: No; REACH SVHC: No SVHC; Lead Free: Lead Free; ComponentLink1URL: https://datasheet.ciiva.com/2026/tps62141-2026276.pdf; ComponentLink1Description: https://datasheet.ciiva.com/2026/tps62141-2026276.pdf; ComponentLink2URL: https://datasheet.ciiva.com/26100/tps62140-26100664.pdf; ComponentLink2Description: https://datasheet.ciiva.com/26100/tps62140-26100664.pdf; ComponentLink3URL: https://datasheet.ciiva.com/28671/1781879-28671384.pdf; ComponentLink3Description: https://datasheet.ciiva.com/28671/1781879-28671384.pdf; ComponentLink4URL: https://datasheet.ciiva.com/2026/tps62140-2026283.pdf; ComponentLink4Description: https://datasheet.ciiva.com/2026/tps62140-2026283.pdf; ComponentLink5URL: https://datasheet.ciiva.com/2026/tps62140-2026284.pdf; ComponentLink5Description: https://datasheet.ciiva.com/2026/tps62140-2026284.pdf; Supplier Part Number 1: 296-29941-6-ND; Manufacturer Part Number: TPS62143RGTT
U6 = LTC1983ES6-5#TRMPBF: IC REG SWITCHD CAP INV -5V SOT23; Manufacturer: Linear Technology; Output Type: Fixed; Number of Outputs: 1; Voltage - Input: 2.3 V ~ 5.5 V; PWM Type: Burst Mode®; Frequency - Switching: 900kHz; Current - Output: 100mA; Synchronous Rectifier: No; Supplier 1: Digi-Key; RoHS: RoHS Compliant; Category: Integrated Circuits (ICs); Stock 1: 6466; Pricing 1: 1=4.28, 25=3.8192, 100=3.4371 (USD); Packaging: Cut Tape (CT); Type: Switched Capacitor (Charge Pump), Inverting; Voltage - Output: -5V; Operating Temperature: -40°C ~ 85°C; Mounting Type: Surface Mount; Package / Case: SOT-23-6 Thin, TSOT-23-6; Supplier Device Package: TSOT-23-6; ComponentLink1URL: http://www.linear.com/docs/2135; ComponentLink1Description: http://www.linear.com/docs/2135; Supplier Part Number 1: LTC1983ES6-5#TRMPBFCT-ND; Manufacturer Part Number: LTC1983ES6-5#TRMPBF
U7 = ADP3303ARZ-3.3-RL7: Linear Voltage Regulator IC Positive Fixed 1 Output 3.3V 200mA 8-SOIC; Manufacturer: Analog Devices Inc.; Voltage - Dropout (Typical): 0.18V @ 200mA; Number of Regulators: 1; Voltage - Input: Up to 12V; Supplier 1: Digi-Key; RoHS: RoHS Compliant; Category: Integrated Circuits (ICs); Stock 1: 2012; Pricing 1: 1=3.19, 10=2.867, 100=2.3517, 500=2.0007 (USD); Packaging: Cut Tape (CT); Part Status: Active; Regulator Topology: Positive Fixed; Voltage - Output: 3.3V; Current - Output: 200mA; Current - Limit (Min): -; Operating Temperature: -25°C ~ 125°C; Mounting Type: Surface Mount; Package / Case: 8-SOIC (0.154", 3.90mm Width); Supplier Device Package: 8-SOIC; ComponentLink1URL: http://www.analog.com/media/en/technical-documentation/data-sheets/ADP3303.pdf; ComponentLink1Description: http://www.analog.com/media/en/technical-documentation/data-sheets/ADP3303.pdf; Supplier Part Number 1: ADP3303ARZ-3.3-RL7CT-ND; Manufacturer Part Number: ADP3303ARZ-3.3-RL7

## Sheet Audio_Output_Line_Out.SchDoc: Audio Output: Line Out
size 279 x 215 mm; DrawnBy: Connor Dack; Engineer: Connor Dack; DocumentNumber: 18; Revision: 1.0; SheetNumber: 18; SheetTotal: 20
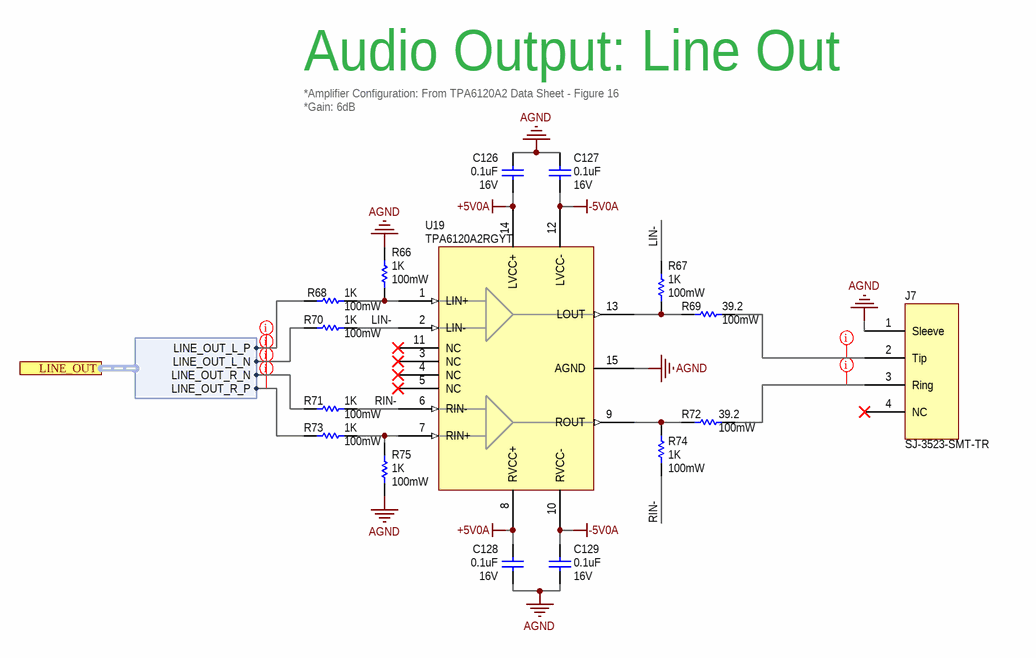
[diagram p6: Audio_Output_Line_Out.SchDoc]

### Parts
C126  Voltage Rating: 16V  Capacitance: 0.1uF  [3-0603_L]  (hidden comment: CL10F104ZO8NNNC)
C127  Voltage Rating: 16V  Capacitance: 0.1uF  [3-0603_L]  (hidden comment: CL10F104ZO8NNNC)
C128  Voltage Rating: 16V  Capacitance: 0.1uF  [3-0603_L]  (hidden comment: CL10F104ZO8NNNC)
C129  Voltage Rating: 16V  Capacitance: 0.1uF  [3-0603_L]  (hidden comment: CL10F104ZO8NNNC)
J7  SJ-3523-SMT-TR  [SJ-3523-SMT-TR]
R66  Power (Watts): 100mW  Resistance (Ohms): 1K  [3-0603_R_L]  (hidden comment: ERJ-3EKF1001V)
R67  Power (Watts): 100mW  Resistance (Ohms): 1K  [3-0603_R_L]  (hidden comment: ERJ-3EKF1001V)
R68  Power (Watts): 100mW  Resistance (Ohms): 1K  [3-0603_R_L]  (hidden comment: ERJ-3EKF1001V)
R69  Power (Watts): 100mW  Resistance (Ohms): 39.2  [3-0603_R_L]  (hidden comment: ERJ-3EKF39R2V)
R70  Power (Watts): 100mW  Resistance (Ohms): 1K  [3-0603_R_L]  (hidden comment: ERJ-3EKF1001V)
R71  Power (Watts): 100mW  Resistance (Ohms): 1K  [3-0603_R_L]  (hidden comment: ERJ-3EKF1001V)
R72  Power (Watts): 100mW  Resistance (Ohms): 39.2  [3-0603_R_L]  (hidden comment: ERJ-3EKF39R2V)
R73  Power (Watts): 100mW  Resistance (Ohms): 1K  [3-0603_R_L]  (hidden comment: ERJ-3EKF1001V)
R74  Power (Watts): 100mW  Resistance (Ohms): 1K  [3-0603_R_L]  (hidden comment: ERJ-3EKF1001V)
R75  Power (Watts): 100mW  Resistance (Ohms): 1K  [3-0603_R_L]  (hidden comment: ERJ-3EKF1001V)
U19  TPA6120A2RGYT  [PQFN50P350X350X100_HS-15N]

### Ports
LINE_OUT (harness LINE_OUT)

### Harnesses
LINE_OUT: LINE_OUT_L_N, LINE_OUT_L_P, LINE_OUT_R_N, LINE_OUT_R_P

### Nets
+5V0A: C126.2 C128.1 U19.8(RVCC+) U19.14(LVCC+)
-5V0A: C127.2 C129.1 U19.10(RVCC-) U19.12(LVCC-)
AGND: C126.1 C127.1 C128.2 C129.2 J7.1(Sleeve) R66.2 R75.1 U19.15(AGND)
LIN-: R67.1 R70.2 U19.2(LIN-)
RIN-: R71.2 R74.2 U19.6(RIN-)
NetJ7_2: J7.2(Tip) R69.2
NetJ7_3: J7.3(Ring) R72.2
NetR66_1: R66.1 R68.2 U19.1(LIN+)
NetR67_2: R67.2 R69.1 U19.13(LOUT)
NetR68_1: R68.1 ; port LINE_OUT.LINE_OUT_L_P
NetR70_1: R70.1 ; port LINE_OUT.LINE_OUT_L_N
NetR71_1: R71.1 ; port LINE_OUT.LINE_OUT_R_N
NetR72_1: R72.1 R74.1 U19.9(ROUT)
NetR73_1: R73.1 ; port LINE_OUT.LINE_OUT_R_P
NetR73_2: R73.2 R75.2 U19.7(RIN+)

Not connected (* = marked no-connect by the designer): J7 4(NC)*; U19 3(NC)* 4(NC)* 5(NC)* 11(NC)*

### Layout directives
net class Line_Out: NetR68_1, NetR70_1, NetR71_1, NetR73_1
net class Line_Out_3.5mm: NetJ7_2, NetJ7_3

### Notes on the sheet
- Audio Output: Line Out
- *Amplifier Configuration: From TPA6120A2 Data Sheet - Figure 16
  *Gain: 6dB
- Title:
- Sheet:
- of
- Size:
- 11 x 8.5 Inches
- Rev:
- Date:
- Engineer:
- Time:
- File:
- Copyright 2020 Audio Logic Inc
  THE HARDWARE IS PROVIDED "AS IS", WITHOUT WARRANTY OF ANY KIND, EXPRESS OR IMPLIED, INCLUDING BUT NOT LIMITED TO THE WARRANTIES OF MERCHANTABILITY, FITNESS FOR A PARTICULAR PURPOSE AND NONINFRINGEMENT. IN NO EVENT SHALL THE AUTHORS OR COPYRIGHT HOLDERS BE LIABLE FOR ANY CLAIM, DAMAGES OR OTHER LIABILITY, WHETHER IN AN ACTION OF CONTRACT, TORT OR OTHERWISE, ARISING FROM, OUT OF OR IN CONNECTION WITH THE HARDWARE OR THE USE OR OTHER DEALINGS IN THE HARDWARE.

### Library data of the parts
C126-C129 = CL10F104ZO8NNNC: as C24 on sheet Power; Supplier 1: Digi-Key; Stock 1: 40000; Pricing 1: 1=0.1, 10=0.038, 100=0.0169, 500=0.01208, 1000=0.00949 (USD); Mount: Surface Mount; Case/Package: 0603; Case Code (Metric): 1608; Case Code (Imperial): 0603; Min Operating Temperature: -30°C; Max Operating Temperature: 85°C; Package Quantity: 1; Packaging: Tape and Reel; Dielectric: Y5V; Length: 1.6mm; Height: 0.8mm; Width: 0.031inch; Thickness: 0.035inch; Depth: 0.8mm; Radiation Hardening: No; ComponentLink1URL: https://datasheet.ciiva.com/25805/cl10f104zo8nnnc-25805810.pdf; ComponentLink1Description: https://datasheet.ciiva.com/25805/cl10f104zo8nnnc-25805810.pdf; ComponentLink2URL: https://datasheet.ciiva.com/16199/cl10f104zo8nnnc-16199254.pdf; ComponentLink2Description: https://datasheet.ciiva.com/16199/cl10f104zo8nnnc-16199254.pdf; Supplier Part Number 1: 1276-1258-6-ND; Manufacturer Part Number: CL10F104ZO8NNNC
J7 = SJ-3523-SMT-TR: 3.50mm (0.141", 1/8", Mini Plug) - Headphone Phone Jack Stereo Connector Solder; Manufacturer: CUI Inc.; Gender: Female; Actual Diameter: 0.142" (3.60mm); Number of Positions/Contacts: 3 Conductors, 3 Contacts; Internal Switch(s): Does Not Contain Switch; Shielding: Unshielded; Voltage - Rated: 12VDC; Current Rating: 1A; Mating Length/Depth: 0.551" (14.00mm); Body Color: Black; Includes: 1 pc - 1 Connector; Notes: FE Provides: 23; LatestRevisionDate: 17-Jul-2002; LatestRevisionNote: Re-released for DXP Platform.; Publisher: Altium Limited; Supplier 1: Digi-Key; RoHS: RoHS Compliant; Category: Connectors, Interconnects; Stock 1: 104981; Pricing 1: 1=1.34, 10=1.043, 100=0.7961, 500=0.63558 (USD); Packaging: Cut Tape (CT); Part Status: Active; Connector Type: Phone Jack; Signal Lines: Stereo; Industry Recognized Mating Diameter: 3.50mm (0.141", 1/8", Mini Plug) - Headphone; Mounting Type: Surface Mount, Right Angle; Termination: Solder; Features: Board Guide; Insulation Color: -; Contact Material - Plating: Silver; Body Material: -; ComponentLink1URL: http://www.cui.com/product/resource/digikeypdf/sj-352x-smt_series.pdf; ComponentLink1Description: http://www.cui.com/product/resource/digikeypdf/sj-352x-smt_series.pdf; Supplier Part Number 1: CP-3523SJCT-ND; Manufacturer Part Number: SJ-3523-SMT-TR
R66-R68 R70 R71 R73-R75 = ERJ-3EKF1001V: RES 1.00K OHM 1/10W 1% 0603 SMD; Manufacturer: Panasonic - ECG; Temperature Coefficient: ±100ppm/°C; Supplier 1: Digi-Key; Manufacturer Part Number: ERJ-3EKF1001V; RoHS: RoHS Compliant; Category: Resistors; Stock 1: 5088743; Pricing 1: 1=0.04, 50=0.0138, 100=0.0105, 250=0.0078, 500=0.00576, 1000=0.00384 (USD); Composition: Thick Film; Features: -; Tolerance: ±1%; Package / Case: 0603 (1608 Metric); Size / Dimension: 0.063" L x 0.031" W (1.60mm x 0.80mm); Height: 0.022" (0.55mm); Number of Terminations: 2; Packaging: Cut Tape (CT); ComponentLink1URL: http://industrial.panasonic.com/www-cgi/jvcr13pz.cgi?E+PZ+3+AOA0002+ERJ3EKF1001V+7+WW; ComponentLink1Description: http://industrial.panasonic.com/www-cgi/jvcr13pz.cgi?E+PZ+3+AOA0002+ERJ3EKF1001V+7+WW; Supplier Part Number 1: P1.00KHCT-ND
R69 R72 = ERJ-3EKF39R2V: n RES SMD 39.2 OHM 1% 1/10W 0603; Manufacturer: Panasonic Electronic Components; Temperature Coefficient: ±100ppm/°C; Supplier 1: Digi-Key; Manufacturer Part Number: ERJ-3EKF39R2V; RoHS: RoHS Compliant; Category: Resistors; Stock 1: 34148; Pricing 1: 1=0.1, 50=0.0114, 100=0.0084, 250=0.00644, 500=0.00514, 1000=0.00379 (USD); Packaging: Cut Tape (CT); Part Status: Active; Tolerance: ±1%; Composition: Thick Film; Features: Automotive AEC-Q200; Operating Temperature: -55°C ~ 155°C; Package / Case: 0603 (1608 Metric); Supplier Device Package: 0603; Size / Dimension: 0.063" L x 0.031" W (1.60mm x 0.80mm); Height: 0.022" (0.55mm); Number of Terminations: 2; ComponentLink1URL: http://industrial.panasonic.com/www-cgi/jvcr13pz.cgi?E+PZ+3+AOA0002+ERJ3EKF39R2V+7+WW; ComponentLink1Description: http://industrial.panasonic.com/www-cgi/jvcr13pz.cgi?E+PZ+3+AOA0002+ERJ3EKF39R2V+7+WW; Supplier Part Number 1: P39.2HCT-ND
U19 = TPA6120A2RGYT: Amplifier IC Headphones, 2-Channel (Stereo) Class AB 14-VQFN (3.5x3.5); Manufacturer: Texas Instruments; Max Output Power x Channels @ Load: 80mW x 2 @ 600 Ohm; Voltage - Supply: 10 V ~ 30 V, ±5 V ~ 15 V; LatestRevisionDate: 17-Jul-2002; LatestRevisionNote: Re-released for DXP Platform.; Publisher: Altium Limited; Supplier 1: Digi-Key; RoHS: RoHS Compliant; Category: Integrated Circuits (ICs); Stock 1: 867; Pricing 1: 1=6.04, 10=5.424, 100=4.4501 (USD); Packaging: Cut Tape (CT); Part Status: Active; Type: Class AB; Output Type: Headphones, 2-Channel (Stereo); Features: Differential Inputs, Short-Circuit and Thermal Protection; Mounting Type: Surface Mount; Operating Temperature: -40°C ~ 85°C (TA); Supplier Device Package: 14-VQFN (3.5x3.5); Package / Case: 14-VFQFN Exposed Pad; ComponentLink1URL: http://www.ti.com/lit/ds/symlink/tpa6120a2.pdf; ComponentLink1Description: http://www.ti.com/lit/ds/symlink/tpa6120a2.pdf; Supplier Part Number 1: 296-38029-1-ND; Manufacturer Part Number: TPA6120A2RGYT

## Sheet Audio_Output_XLR1.SchDoc: Audio Out: Mini XLR 1
size 279 x 215 mm; DrawnBy: Connor Dack; Engineer: Connor Dack; DocumentNumber: 19; Revision: 1.0; SheetNumber: 19; SheetTotal: 20
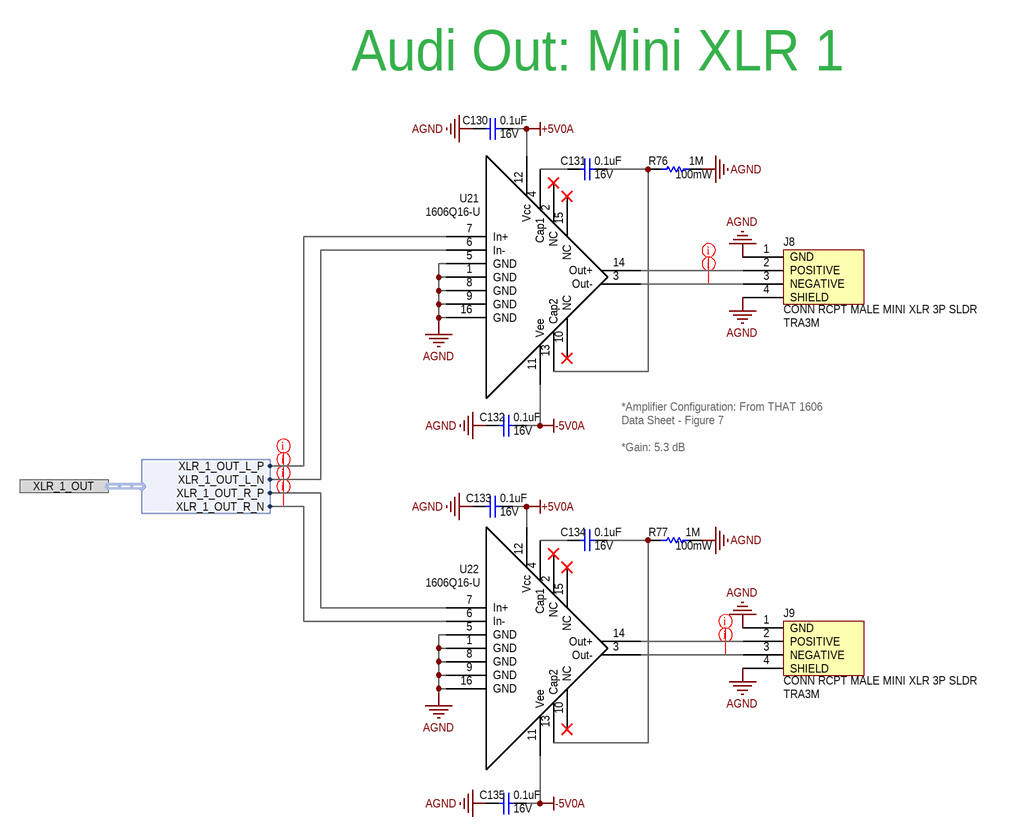
[diagram p7: Audio_Output_XLR1.SchDoc]

### Parts
C130  Voltage Rating: 16V  Capacitance: 0.1uF  [3-0603_L]  (hidden comment: CL10F104ZO8NNNC)
C131  Voltage Rating: 16V  Capacitance: 0.1uF  [3-0603_L]  (hidden comment: CL10F104ZO8NNNC)
C132  Voltage Rating: 16V  Capacitance: 0.1uF  [3-0603_L]  (hidden comment: CL10F104ZO8NNNC)
C133  Voltage Rating: 16V  Capacitance: 0.1uF  [3-0603_L]  (hidden comment: CL10F104ZO8NNNC)
C134  Voltage Rating: 16V  Capacitance: 0.1uF  [3-0603_L]  (hidden comment: CL10F104ZO8NNNC)
C135  Voltage Rating: 16V  Capacitance: 0.1uF  [3-0603_L]  (hidden comment: CL10F104ZO8NNNC)
J8  CONN RCPT MALE MINI XLR 3P SLDR  [TRA3M]
J9  CONN RCPT MALE MINI XLR 3P SLDR  [TRA3M]
R76  Max Power Dissipation: 100mW  Resistance: 1M  [3-0603_R_L]  (hidden comment: RMCF0603FG1M00)
R77  Max Power Dissipation: 100mW  Resistance: 1M  [3-0603_R_L]  (hidden comment: RMCF0603FG1M00)
U21  1606Q16-U  [SOP64P600X175-16N]
U22  1606Q16-U  [SOP64P600X175-16N]

### Ports
XLR_1_OUT (harness XLR_1_OUT)

### Harnesses
XLR_1_OUT: XLR_1_OUT_L_N, XLR_1_OUT_L_P, XLR_1_OUT_R_N, XLR_1_OUT_R_P

### Nets
+5V0A: C130.1 C133.1 U21.12(Vcc) U22.12(Vcc)
-5V0A: C132.1 C135.1 U21.11(Vee) U22.11(Vee)
AGND: C130.2 C132.2 C133.2 C135.2 J8.1(GND) J8.4(SHIELD) J9.1(GND) J9.4(SHIELD) R76.2 R77.2 U21.1(GND) U21.5(GND) U21.8(GND) U21.9(GND) U21.16(GND) U22.1(GND) U22.5(GND) U22.8(GND) U22.9(GND) U22.16(GND)
NetC131_1: C131.1 R76.1 U21.13(Cap2)
NetC131_2: C131.2 U21.4(Cap1)
NetC134_1: C134.1 R77.1 U22.13(Cap2)
NetC134_2: C134.2 U22.4(Cap1)
NetJ8_2: J8.2(POSITIVE) U21.14(Out+)
NetJ8_3: J8.3(NEGATIVE) U21.3(Out-)
NetJ9_2: J9.2(POSITIVE) U22.14(Out+)
NetJ9_3: J9.3(NEGATIVE) U22.3(Out-)
NetU1_6: U21.7(In+) ; port XLR_1_OUT.XLR_1_OUT_L_P
NetU1_7: U21.6(In-) ; port XLR_1_OUT.XLR_1_OUT_L_N
NetU1_8: U22.7(In+) ; port XLR_1_OUT.XLR_1_OUT_R_P
NetU1_9: U22.6(In-) ; port XLR_1_OUT.XLR_1_OUT_R_N

Not connected (* = marked no-connect by the designer): U21 2(NC)* 10(NC)* 15(NC)*; U22 2(NC)* 10(NC)* 15(NC)*

### Layout directives
net class XLR_1_Out: NetU1_6, NetU1_7, NetU1_8, NetU1_9
net class XLR_1_Out_Conn: NetJ8_2, NetJ8_3, NetJ9_2, NetJ9_3

### Notes on the sheet
- (near C130) Audi Out: Mini XLR 1
- *Amplifier Configuration: From THAT 1606 Data Sheet - Figure 7
  *Gain: 5.3 dB
- Title:
- Sheet:
- of
- Size:
- 11 x 8.5 Inches
- Rev:
- Date:
- Engineer:
- Time:
- File:
- Copyright 2020 Audio Logic Inc
  THE HARDWARE IS PROVIDED "AS IS", WITHOUT WARRANTY OF ANY KIND, EXPRESS OR IMPLIED, INCLUDING BUT NOT LIMITED TO THE WARRANTIES OF MERCHANTABILITY, FITNESS FOR A PARTICULAR PURPOSE AND NONINFRINGEMENT. IN NO EVENT SHALL THE AUTHORS OR COPYRIGHT HOLDERS BE LIABLE FOR ANY CLAIM, DAMAGES OR OTHER LIABILITY, WHETHER IN AN ACTION OF CONTRACT, TORT OR OTHERWISE, ARISING FROM, OUT OF OR IN CONNECTION WITH THE HARDWARE OR THE USE OR OTHER DEALINGS IN THE HARDWARE.

### Library data of the parts
C130-C135 = CL10F104ZO8NNNC: as C24 on sheet Power; Supplier 1: Digi-Key; Stock 1: 40000; Pricing 1: 1=0.1, 10=0.038, 100=0.0169, 500=0.01208, 1000=0.00949 (USD); Mount: Surface Mount; Case/Package: 0603; Case Code (Metric): 1608; Case Code (Imperial): 0603; Min Operating Temperature: -30°C; Max Operating Temperature: 85°C; Package Quantity: 1; Packaging: Tape and Reel; Dielectric: Y5V; Length: 1.6mm; Height: 0.8mm; Width: 0.031inch; Thickness: 0.035inch; Depth: 0.8mm; Radiation Hardening: No; ComponentLink1URL: https://datasheet.ciiva.com/25805/cl10f104zo8nnnc-25805810.pdf; ComponentLink1Description: https://datasheet.ciiva.com/25805/cl10f104zo8nnnc-25805810.pdf; ComponentLink2URL: https://datasheet.ciiva.com/16199/cl10f104zo8nnnc-16199254.pdf; ComponentLink2Description: https://datasheet.ciiva.com/16199/cl10f104zo8nnnc-16199254.pdf; Supplier Part Number 1: 1276-1258-6-ND; Manufacturer Part Number: CL10F104ZO8NNNC
J8 J9 = TRA3M: 3 Position Circular Connector Receptacle, Male Pins Solder Silver; Manufacturer: Switchcraft; Body Material: Metal,Copper Alloy; Max Current Rating: 5A; Max Voltage Rating (AC): 125V; Voltage Rating: 250V; Connector Type: Receptacle,Pin; Number of Positions: 3; Number of Ports: 1; Wire/Cable Gauge: 28AWG; Supplier 1: Digi-Key; Stock 1: 295; Pricing 1: 1=12.74, 10=9.754, 25=9.5096, 50=8.7782, 100=8.2906, 250=7.9248 (USD); Mount: Through Hole,Panel,Bulkhead,PCB; Case/Package: Metal; Contact Material: Brass,Copper Alloy; Contact Plating: Nickel,Tin,Silver; Colour: Black; Number of Terminals: 3; Housing Material: Copper Alloy; Insulation Material: Thermoplastic; Min Operating Temperature: -55°C; Max Operating Temperature: 85°C; Package Quantity: 1; Current Rating: 5A; Fastening Type: Threaded; Packaging: Bulk; Gender: Male; Termination: Solder; Number of Contacts: 3; Orientation: Right Angle; Length: 15.49mm; Height: 15.24mm; Depth: 26.92mm; REACH SVHC: No SVHC; Lead Free: Lead Free; ComponentLink1URL: https://datasheet.ciiva.com/7327/tra3m-series-cd-7327368.pdf; ComponentLink1Description: https://datasheet.ciiva.com/7327/tra3m-series-cd-7327368.pdf; ComponentLink2URL: https://datasheet.ciiva.com/16879/70214235-16879259.pdf; ComponentLink2Description: https://datasheet.ciiva.com/16879/70214235-16879259.pdf; ComponentLink3URL: https://datasheet.ciiva.com/8053/28686-8053836.pdf; ComponentLink3Description: https://datasheet.ciiva.com/8053/28686-8053836.pdf; Supplier Part Number 1: SC1550-ND; Manufacturer Part Number: TRA3M
R76 R77 = RMCF0603FG1M00: RES 1M OHM 1% 1/10W 0603; Manufacturer: Stackpole Electronics; Temperature Coefficient: 100ppm/°C; Supplier 1: Digi-Key; Manufacturer Part Number: RMCF0603FG1M00; Stock 1: 129722; Pricing 1: 1=0.1, 10=0.017, 100=0.0069, 1000=0.00309, 2500=0.00268, 5000=0.00222 (USD); Mount: Surface Mount; Case/Package: 0603; Case Code (Metric): 1608; Case Code (Imperial): 0603; Contact Plating: Tin,Matte; Min Operating Temperature: -55°C; Max Operating Temperature: 155°C; Package Quantity: 1; Packaging: Tape and Reel; Tolerance: 1%; Composition: Thick Film; Number of Terminations: 2; Length: 0.061inch; Height: 0.022inch; Width: 0.031inch; Radiation Hardening: No; Lead Free: Contains Lead; ComponentLink1URL: https://www.seielect.com/Catalog/SEI-RMCF_RMCP.pdf; ComponentLink1Description: https://www.seielect.com/Catalog/SEI-RMCF_RMCP.pdf; ComponentLink2URL: https://www.seielect.com/catalog/SEI-Packaging.pdf; ComponentLink2Description: https://www.seielect.com/catalog/SEI-Packaging.pdf; Supplier Part Number 1: RMCF0603FG1M00CT-ND
U21 U22 = 1606Q16-U: Audio Amplifiers Balanced Audio Line Driver IC; Manufacturer: THAT; Max Supply Voltage: 18V; Min Supply Voltage: 4V; Nominal Supply Current: 4.9mA; Supplier 1: Mouser; Stock 1: 3475; Pricing 1: 1=4.65, 10=4.65, 50=3.91, 100=3.35, 1000=2.79, 10000=2.6 (USD); Case/Package: QSOP; Min Operating Temperature: -40°C; Max Operating Temperature: 85°C; Package Quantity: 98; Packaging: Rail/Tube; ComponentLink1URL: http://www.mouser.com/ds/2/407/1600data-6754.pdf; ComponentLink1Description: http://www.mouser.com/ds/2/407/1600data-6754.pdf; Supplier Part Number 1: 887-1606Q16-U; Manufacturer Part Number: 1606Q16-U